# Altium schematic sheet SolenoidsAndPressure.SchDoc: Solenoids & Pressure Transducers
size Legal; DocumentNumber: 8; SheetNumber: 8; SheetTotal: 8; Project: Olympus
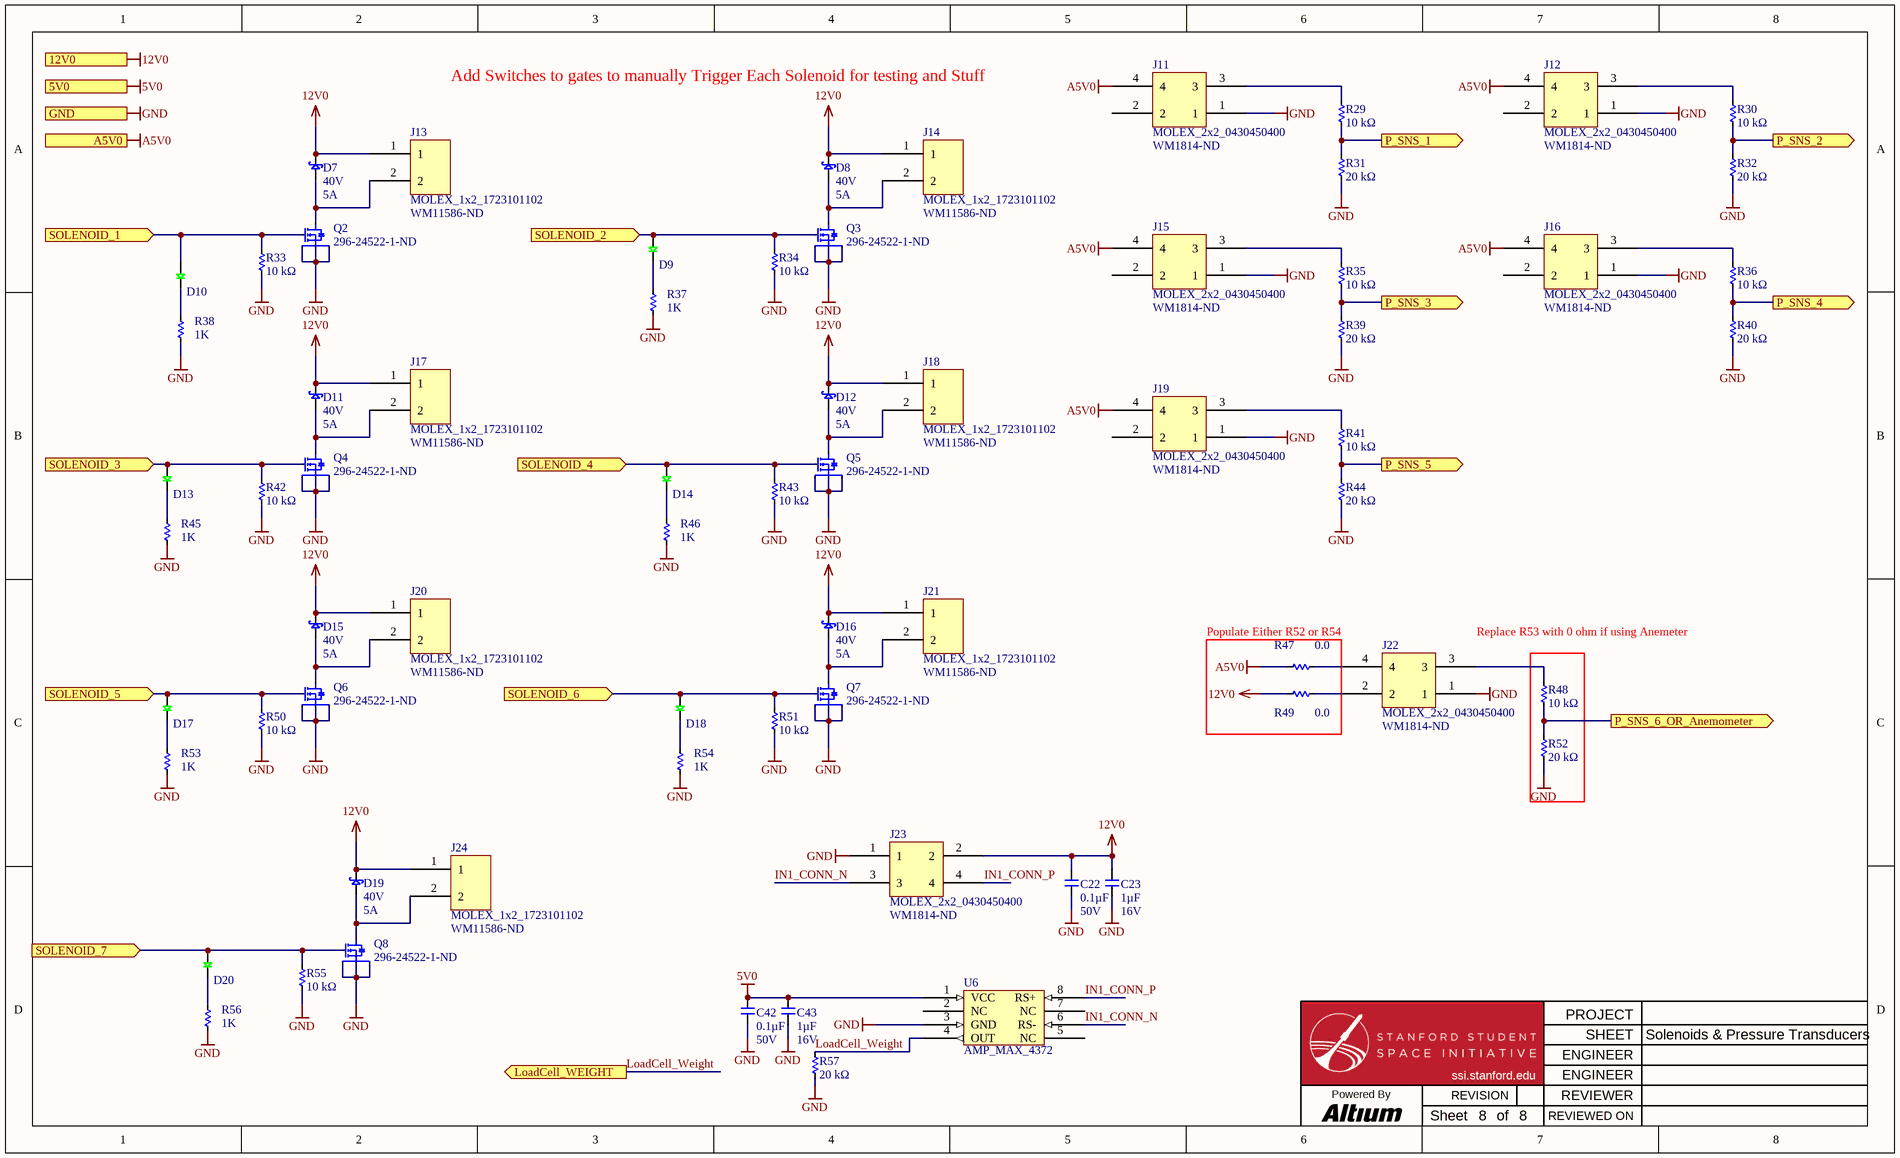
[diagram p0: SolenoidsAndPressure.SchDoc]

## Parts
C22  Capacitance (shorthand): 0.1µF  Rated Voltage: 50V  [C0603P]  (hidden comment: __template_cap)
C23  Capacitance (shorthand): 1µF  Rated Voltage: 16V  [C0603P]  (hidden comment: __template_cap)
C42  Capacitance (shorthand): 0.1µF  Rated Voltage: 50V  [C0603P]  (hidden comment: __template_cap)
C43  Capacitance (shorthand): 1µF  Rated Voltage: 16V  [C0603P]  (hidden comment: __template_cap)
D7  Voltage - DC Reverse (Vr) (Max): 40V  Current - Average Rectified (Io): 5A  [SMC]  (hidden comment: DIODE SCHOTTKY 40V 5A SMC)
D8  Voltage - DC Reverse (Vr) (Max): 40V  Current - Average Rectified (Io): 5A  [SMC]  (hidden comment: DIODE SCHOTTKY 40V 5A SMC)
D9  LED_C503B-GCS-CB0C0781  [LED_TH_5MM]  (value not drawn)
D10  LED_C503B-GCS-CB0C0781  [LED_TH_5MM]  (value not drawn)
D11  Voltage - DC Reverse (Vr) (Max): 40V  Current - Average Rectified (Io): 5A  [SMC]  (hidden comment: DIODE SCHOTTKY 40V 5A SMC)
D12  Voltage - DC Reverse (Vr) (Max): 40V  Current - Average Rectified (Io): 5A  [SMC]  (hidden comment: DIODE SCHOTTKY 40V 5A SMC)
D13  LED_C503B-GCS-CB0C0781  [LED_TH_5MM]  (value not drawn)
D14  LED_C503B-GCS-CB0C0781  [LED_TH_5MM]  (value not drawn)
D15  Voltage - DC Reverse (Vr) (Max): 40V  Current - Average Rectified (Io): 5A  [SMC]  (hidden comment: DIODE SCHOTTKY 40V 5A SMC)
D16  Voltage - DC Reverse (Vr) (Max): 40V  Current - Average Rectified (Io): 5A  [SMC]  (hidden comment: DIODE SCHOTTKY 40V 5A SMC)
D17  LED_C503B-GCS-CB0C0781  [LED_TH_5MM]  (value not drawn)
D18  LED_C503B-GCS-CB0C0781  [LED_TH_5MM]  (value not drawn)
D19  Voltage - DC Reverse (Vr) (Max): 40V  Current - Average Rectified (Io): 5A  [SMC]  (hidden comment: DIODE SCHOTTKY 40V 5A SMC)
D20  LED_C503B-GCS-CB0C0781  [LED_TH_5MM]  (value not drawn)
J11  MOLEX_2x2_0430450400  Supplier Part Number 1: WM1814-ND  [MOLEX_2x2_0430450400]
J12  MOLEX_2x2_0430450400  Supplier Part Number 1: WM1814-ND  [MOLEX_2x2_0430450400]
J13  MOLEX_1x2_1723101102  Supplier Part Number 1: WM11586-ND  [MOLEX_1x2_1723101102]
J14  MOLEX_1x2_1723101102  Supplier Part Number 1: WM11586-ND  [MOLEX_1x2_1723101102]
J15  MOLEX_2x2_0430450400  Supplier Part Number 1: WM1814-ND  [MOLEX_2x2_0430450400]
J16  MOLEX_2x2_0430450400  Supplier Part Number 1: WM1814-ND  [MOLEX_2x2_0430450400]
J17  MOLEX_1x2_1723101102  Supplier Part Number 1: WM11586-ND  [MOLEX_1x2_1723101102]
J18  MOLEX_1x2_1723101102  Supplier Part Number 1: WM11586-ND  [MOLEX_1x2_1723101102]
J19  MOLEX_2x2_0430450400  Supplier Part Number 1: WM1814-ND  [MOLEX_2x2_0430450400]
J20  MOLEX_1x2_1723101102  Supplier Part Number 1: WM11586-ND  [MOLEX_1x2_1723101102]
J21  MOLEX_1x2_1723101102  Supplier Part Number 1: WM11586-ND  [MOLEX_1x2_1723101102]
J22  MOLEX_2x2_0430450400  Supplier Part Number 1: WM1814-ND  [MOLEX_2x2_0430450400]
J23  MOLEX_2x2_0430450400  Supplier Part Number 1: WM1814-ND  [MOLEX_2x2_0430450400]
J24  MOLEX_1x2_1723101102  Supplier Part Number 1: WM11586-ND  [MOLEX_1x2_1723101102]
Q2  Supplier Part Number 1: 296-24522-1-ND  [8-VSON]  (hidden comment: NFET_CSD16323Q3)
Q3  Supplier Part Number 1: 296-24522-1-ND  [8-VSON]  (hidden comment: NFET_CSD16323Q3)
Q4  Supplier Part Number 1: 296-24522-1-ND  [8-VSON]  (hidden comment: NFET_CSD16323Q3)
Q5  Supplier Part Number 1: 296-24522-1-ND  [8-VSON]  (hidden comment: NFET_CSD16323Q3)
Q6  Supplier Part Number 1: 296-24522-1-ND  [8-VSON]  (hidden comment: NFET_CSD16323Q3)
Q7  Supplier Part Number 1: 296-24522-1-ND  [8-VSON]  (hidden comment: NFET_CSD16323Q3)
Q8  Supplier Part Number 1: 296-24522-1-ND  [8-VSON]  (hidden comment: NFET_CSD16323Q3)
R29  Resistance: 10 kΩ  [R0603]  (hidden comment: __template_resistor)
R30  Resistance: 10 kΩ  [R0603]  (hidden comment: __template_resistor)
R31  Resistance: 20 kΩ  [R0603]  (hidden comment: __template_resistor)
R32  Resistance: 20 kΩ  [R0603]  (hidden comment: __template_resistor)
R33  Resistance: 10 kΩ  [R0603]  (hidden comment: __template_resistor)
R34  Resistance: 10 kΩ  [R0603]  (hidden comment: __template_resistor)
R35  Resistance: 10 kΩ  [R0603]  (hidden comment: __template_resistor)
R36  Resistance: 10 kΩ  [R0603]  (hidden comment: __template_resistor)
R37  value 1K  [R0603]  (hidden comment: __template_resistor)
R38  value 1K  [R0603]  (hidden comment: __template_resistor)
R39  Resistance: 20 kΩ  [R0603]  (hidden comment: __template_resistor)
R40  Resistance: 20 kΩ  [R0603]  (hidden comment: __template_resistor)
R41  Resistance: 10 kΩ  [R0603]  (hidden comment: __template_resistor)
R42  Resistance: 10 kΩ  [R0603]  (hidden comment: __template_resistor)
R43  Resistance: 10 kΩ  [R0603]  (hidden comment: __template_resistor)
R44  Resistance: 20 kΩ  [R0603]  (hidden comment: __template_resistor)
R45  value 1K  [R0603]  (hidden comment: __template_resistor)
R46  value 1K  [R0603]  (hidden comment: __template_resistor)
R47  Resistance (Ohms): 0.0  [R0805]  (hidden comment: RES_0.0_OHM_1/8W_JUMP_0805_SMD)
R48  Resistance: 10 kΩ  [R0603]  (hidden comment: __template_resistor)
R49  Resistance (Ohms): 0.0  [R0805]  (hidden comment: RES_0.0_OHM_1/8W_JUMP_0805_SMD)
R50  Resistance: 10 kΩ  [R0603]  (hidden comment: __template_resistor)
R51  Resistance: 10 kΩ  [R0603]  (hidden comment: __template_resistor)
R52  Resistance: 20 kΩ  [R0603]  (hidden comment: __template_resistor)
R53  value 1K  [R0603]  (hidden comment: __template_resistor)
R54  value 1K  [R0603]  (hidden comment: __template_resistor)
R55  Resistance: 10 kΩ  [R0603]  (hidden comment: __template_resistor)
R56  value 1K  [R0603]  (hidden comment: __template_resistor)
R57  Resistance: 20 kΩ  [R0603]  (hidden comment: __template_resistor)
U6  AMP_MAX_4372  [8SOIC150E]

## Blocks framed on the sheet
Populate Either R52 or R54: R47 R49

## Ports
5V0 (in), 12V0 (in), A5V0 (in), GND (in), LoadCell_WEIGHT (out), P_SNS_1 (out), P_SNS_2 (out), P_SNS_3 (out), P_SNS_4 (out), P_SNS_5 (out), P_SNS_6_OR_Anemometer (out), SOLENOID_1 (in), SOLENOID_2 (in), SOLENOID_3 (in), SOLENOID_4 (in), SOLENOID_5 (in), SOLENOID_6 (in), SOLENOID_7 (in)

## Nets
5V0: C42.1 C43.1 U6.1(VCC) ; port 5V0
12V0: C22.1 C23.1 D7.2 D8.2 D11.2 D12.2 D15.2 D16.2 D19.2 J13.1 J14.1 J17.1 J18.1 J20.1 J21.1 J23.2 J24.1 R49.1 ; port 12V0
A5V0: J11.4 J12.4 J15.4 J16.4 J19.4 R47.1 ; port A5V0
GND: C22.2 C23.2 C42.2 C43.2 J11.1 J12.1 J15.1 J16.1 J19.1 J22.1 J23.1 Q2.1(S) Q2.2(S) Q2.3(S) Q3.1(S) Q3.2(S) Q3.3(S) Q4.1(S) Q4.2(S) Q4.3(S) Q5.1(S) Q5.2(S) Q5.3(S) Q6.1(S) Q6.2(S) Q6.3(S) Q7.1(S) Q7.2(S) Q7.3(S) Q8.1(S) Q8.2(S) Q8.3(S) R31.1 R32.1 R33.1 R34.1 R37.1 R38.1 R39.1 R40.1 R42.1 R43.1 R44.1 R45.1 R46.1 R50.1 R51.1 R52.1 R53.1 R54.1 R55.1 R56.1 R57.1 U6.3(GND) ; port GND
IN1_CONN_N: J23.3 U6.6(RS-)
IN1_CONN_P: J23.4 U6.8(RS+)
LoadCell_Weight: R57.2 U6.4(OUT) ; port LoadCell_WEIGHT
P_SNS_1: R29.1 R31.2 ; port P_SNS_1
P_SNS_2: R30.1 R32.2 ; port P_SNS_2
P_SNS_3: R35.1 R39.2 ; port P_SNS_3
P_SNS_4: R36.1 R40.2 ; port P_SNS_4
P_SNS_5: R41.1 R44.2 ; port P_SNS_5
P_SNS_6_OR_Anemometer: R48.1 R52.2 ; port P_SNS_6_OR_Anemometer
SOLENOID_1: D10.1 Q2.4(G) R33.2 ; port SOLENOID_1
SOLENOID_2: D9.1 Q3.4(G) R34.2 ; port SOLENOID_2
SOLENOID_3: D13.1 Q4.4(G) R42.2 ; port SOLENOID_3
SOLENOID_4: D14.1 Q5.4(G) R43.2 ; port SOLENOID_4
SOLENOID_5: D17.1 Q6.4(G) R50.2 ; port SOLENOID_5
SOLENOID_6: D18.1 Q7.4(G) R51.2 ; port SOLENOID_6
SOLENOID_7: D20.1 Q8.4(G) R55.2 ; port SOLENOID_7
NetD7_1: D7.1 J13.2 Q2.5(D)
NetD8_1: D8.1 J14.2 Q3.5(D)
NetD9_2: D9.2 R37.2
NetD10_2: D10.2 R38.2
NetD11_1: D11.1 J17.2 Q4.5(D)
NetD12_1: D12.1 J18.2 Q5.5(D)
NetD13_2: D13.2 R45.2
NetD14_2: D14.2 R46.2
NetD15_1: D15.1 J20.2 Q6.5(D)
NetD16_1: D16.1 J21.2 Q7.5(D)
NetD17_2: D17.2 R53.2
NetD18_2: D18.2 R54.2
NetD19_1: D19.1 J24.2 Q8.5(D)
NetD20_2: D20.2 R56.2
NetJ11_3: J11.3 R29.2
NetJ12_3: J12.3 R30.2
NetJ15_3: J15.3 R35.2
NetJ16_3: J16.3 R36.2
NetJ19_3: J19.3 R41.2
NetJ22_2: J22.2 R49.2
NetJ22_3: J22.3 R48.2
NetJ22_4: J22.4 R47.2

Not connected (* = marked no-connect by the designer): J11 2; J12 2; J15 2; J16 2; J19 2; U6 2(NC) 5(NC) 7(NC)

## Notes on the sheet
- Add Switches to gates to manually Trigger Each Solenoid for testing and Stuff
- Replace R53 with 0 ohm if using Anemeter
- PROJECT
- SHEET
- Powered By
- Sheet
- of
- REVISION
- ssi.stanford.edu
- ENGINEER
- REVIEWER
- REVIEWED ON

## Library data of the parts
C22 C42 = 490-1519-1-ND: CAP CER 0603 0.1µF X7R 50V 10%; Manufacturer: Murata Electronics North America; Capacitance - pF (Machine readable): #NAME?; type: capacitor; Supplier Part Number 1: 490-1519-1-ND; Dielectric: X7R; Supplier 1: Digikey
C23 C43 = 490-3900-1-ND: CAP CER 0603 1µF X7R 16V 10%; Manufacturer: Murata Electronics North America; Capacitance - pF (Machine readable): #NAME?; type: capacitor; Supplier Part Number 1: 490-3900-1-ND; Dielectric: X7R; Supplier 1: Digikey
D7 D8 D11 D12 D15 D16 D19 = SCHOTTKY_B540C-13-F: Manufacturer: Diodes Inc; Voltage - Forward (Vf) (Max) @ If: 550mV @ 5A; Speed: Fast Recovery =< 500ns, > 200mA (Io); Current - Reverse Leakage @ Vr: 500µA @ 40V; Capacitance @ Vr, F: 300pF @ 4V, 1MHz; Supplier 1: Digi-Key; RoHS: RoHS Compliant; Category: Discrete Semiconductor Products; Stock 1: 22018; Pricing 1: 1=1.06, 10=0.912, 100=0.72, 250=0.624, 500=0.528, 1000=0.42 (USD); Diode Type: Schottky; Reverse Recovery Time (trr): -; Mounting Type: Surface Mount; Package / Case: DO-214AB, SMC; Supplier Device Package: SMC; Packaging: Cut Tape (CT); ComponentLink1URL: http://www.diodes.com/datasheets/ds13012.pdf; Datasheet: http://www.diodes.com/datasheets/ds13012.pdf; Supplier Part Number 1: B540C-FDICT-ND; Manufacturer Part Number: B540C-13-F
D9 D10 D13 D14 D17 D18 D20 = LED_C503B-GCS-CB0C0781: LED GREEN CLEAR 5MM ROUND T/H; pin to pad: 1>A 2>K; Manufacturer: Cree; Lens Colour: Colorless; Luminous Intensity: 24850mcd; Viewing Angle: 30°; Forward Current: 20mA; Forward Voltage: 3.2V; Lens Style: Dome; Dominant Wavelength: 527nm; Power Rating: 120mW; Reverse Voltage (DC): 5V; Number of LEDs: 1; Supplier 1: Digi-Key; Manufacturer Part Number: C503B-GCS-CB0C0781; Stock 1: 191; Pricing 1: 1=0.25, 10=0.236, 100=0.2184, 1000=0.1954, 50000=0.1814 (USD); Mount: Through Hole; Case/Package: Radial; Colour: Green; Min Operating Temperature: -40°C; Max Operating Temperature: 95°C; Illumination Colour: Green; Packaging: Bulk; Package Quantity: 500; Lens Transparency: Clear; Test Current: 20mA; Wavelength: 527nm; Length: 5.8mm; Height: 12.7mm; Width: 5mm; ComponentLink1URL: http://www.mouser.com/ds/2/90/cree.C503B%20BAS%20BAN%20BCS%20BCN%20GAS%20GAN%20GCS%20GCN%201094[1]-310350.pdf; ComponentLink1Description: http://www.mouser.com/ds/2/90/cree.C503B%20BAS%20BAN%20BCS%20BCN%20GAS%20GAN%20GCS%20GCN%201094[1]-310350.pdf; ComponentLink2URL: http://www.cree.com/led-components/media/documents/C503B-BAS-BAN-BCS-BCN-GAS-GAN-GCS-GCN-1094.pdf; ComponentLink2Description: http://www.cree.com/led-components/media/documents/C503B-BAS-BAN-BCS-BCN-GAS-GAN-GCS-GCN-1094.pdf; Supplier Part Number 1: C503B-GCS-CB0C0781-ND
J11 J12 J15 J16 J19 J22 J23 = MOLEX_2x2_0430450400: MICROFIT CONN HEADER R/A 4POS 3MM; Supplier 1: Digi-Key
J13 J14 J17 J18 J20 J21 J24 = MOLEX_1x2_1723101102: ULTRAFIT CONN HEADER R/A 2POS 3.5MM; Supplier 1: Digi-Key
Q2-Q8 = NFET_CSD16323Q3: MOSFET N-CH 25V 3.3X3.3 8-SON; Manufacturer: Texas Instruments; FET Type: MOSFET N-Channel, Metal Oxide; FET Feature: Logic Level Gate; Current - Continuous Drain (Id) @ 25°C: 21A (Ta), 60A (Tc); Rds On (Max) @ Id, Vgs: 4.5 mOhm @ 24A, 8V; Vgs(th) (Max) @ Id: 1.4V @ 250µA; Gate Charge (Qg) @ Vgs: 8.4nC @ 4.5V; Input Capacitance (Ciss) @ Vds: 1300pF @ 12.5V; Power - Max: 3W; Supplier 1: Digi-Key; Manufacturer Part Number: CSD16323Q3; RoHS: RoHS Compliant By Exemption; Category: Discrete Semiconductor Products; Stock 1: 23688; Pricing 1: 1=1.19, 10=1.061, 100=0.8271, 500=0.68404, 1000=0.43625 (USD); Packaging: Cut Tape (CT); Drain to Source Voltage (Vdss): 25V; Operating Temperature: -55°C ~ 150°C (TJ); Mounting Type: Surface Mount; Package / Case: 8-PowerTDFN; Supplier Device Package: 8-VSON (3.3x3.3); ComponentLink1URL: http://www.ti.com/lit/ds/symlink/csd16323q3.pdf; ComponentLink1Description: http://www.ti.com/lit/ds/symlink/csd16323q3.pdf
R29 R30 R33-R36 R41-R43 R48 R50 R51 R55 = RES SMD 10K OHM 1% 1/10W 0603: Manufacturer Part Number: RC0603FR-0710KL; Manufacturer: Yageo; Resistance (Sortable): 10000; Power (Watts): 0.1W, 1/10W; Temperature Coefficient: ±100ppm/°C; Supplier 1: Digikey; Datasheets: http://www.yageo.com/documents/recent/PYu-RC_Group_51_RoHS_L_9.pdf; Image: //media.digikey.com/Renders/Yageo%20Renders/0603-(1608-Metric).jpg; Supplier Part Number 1: 311-10.0KHRCT-ND; Tolerance: ±1%; Operating Temperature: -55°C ~ 155°C
R31 R32 R39 R40 R44 R52 = RES SMD 20K OHM 1% 1/10W 0603: Manufacturer Part Number: RC0603FR-0720KL; Manufacturer: Yageo; Resistance (Sortable): 20000; Power (Watts): 0.1W, 1/10W; Temperature Coefficient: ±100ppm/°C; Supplier 1: Digikey; Datasheets: http://www.yageo.com/documents/recent/PYu-RC_Group_51_RoHS_L_9.pdf; Image: //media.digikey.com/Renders/Yageo%20Renders/0603-(1608-Metric).jpg; Supplier Part Number 1: 311-20.0KHRCT-ND; Tolerance: ±1%; Operating Temperature: -55°C ~ 155°C
R47 R49 = RES_0.0_OHM_1/8W_JUMP_0805_SMD: RES 0.0 OHM 1/8W JUMP 0805 SMD; Manufacturer: Panasonic Electronic Components; Manufacturer Part Number: ERJ-6GEY0R00V; Tolerance: Jumper; Power (Watts): 0.125W, 1/8W; Supplier 1: Digi-Key; RoHS: RoHS Compliant; Category: Resistors; Stock 1: 3323537; Pricing 1: 1=0.1, 10=0.024, 25=0.0172, 50=0.0132, 100=0.0097, 250=0.00744, 500=0.00594, 1000=0.00437 (USD); Packaging: Cut Tape (CT); Part Status: Active; Composition: Thick Film; Features: Automotive AEC-Q200; Temperature Coefficient: -; Operating Temperature: -55°C ~ 155°C; Package / Case: 0805 (2012 Metric); Supplier Device Package: 0805; Size / Dimension: 0.079" L x 0.049" W (2.00mm x 1.25mm); Height - Seated (Max): 0.028" (0.70mm); Number of Terminations: 2; Failure Rate: -; ComponentLink1URL: http://industrial.panasonic.com/www-cgi/jvcr13pz.cgi?E+PZ+3+AOA0001+ERJ6GEY0R00V+7+WW; ComponentLink1Description: http://industrial.panasonic.com/www-cgi/jvcr13pz.cgi?E+PZ+3+AOA0001+ERJ6GEY0R00V+7+WW; Supplier Part Number 1: P0.0ACT-ND
R57 = 311-20.0KHRCT-ND: RES SMD 20K OHM 1% 1/10W 0603; Manufacturer Part Number: RC0603FR-0720KL; Manufacturer: Yageo; Resistance (Sortable): 20000; Power (Watts): 0.1W, 1/10W; Temperature Coefficient: ±100ppm/°C; Supplier Part Number 1: 311-20.0KHRCT-ND; Supplier 1: Digikey; Datasheets: http://www.yageo.com/documents/recent/PYu-RC_Group_51_RoHS_L_9.pdf; Image: //media.digikey.com/Renders/Yageo%20Renders/0603-(1608-Metric).jpg; Tolerance: ±1%; Operating Temperature: -55°C ~ 155°C